# EAGLE design CKTPOWERTRAINEE (EAGLE 9.6.2)
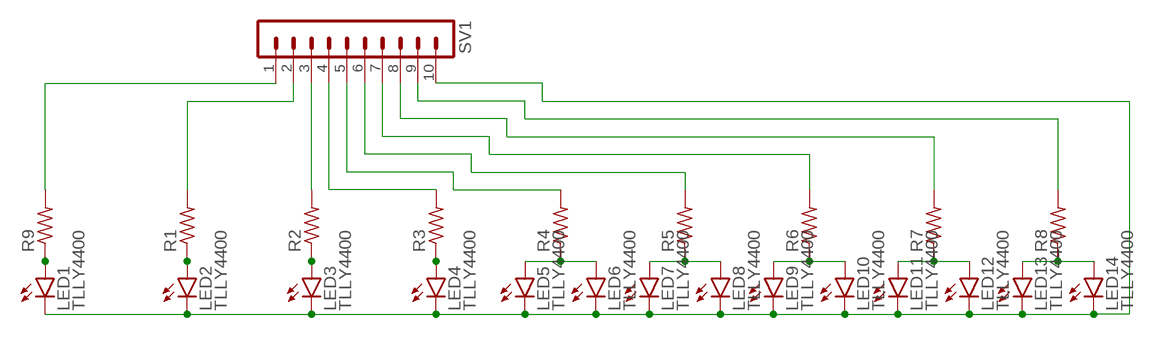
[diagram p0: schematic, sheet 1]

## Parts
LED1  TLLY4400  [LED3MM]
LED2  TLLY4400  [LED3MM]
LED3  TLLY4400  [LED3MM]
LED4  TLLY4400  [LED3MM]
LED5  TLLY4400  [LED3MM]
LED6  TLLY4400  [LED3MM]
LED7  TLLY4400  [LED3MM]
LED8  TLLY4400  [LED3MM]
LED9  TLLY4400  [LED3MM]
LED10  TLLY4400  [LED3MM]
LED11  TLLY4400  [LED3MM]
LED12  TLLY4400  [LED3MM]
LED13  TLLY4400  [LED3MM]
LED14  TLLY4400  [LED3MM]
R1  R-US_0309/12  [0309/12]
R2  R-US_0309/12  [0309/12]
R3  R-US_0309/12  [0309/12]
R4  R-US_0309/12  [0309/12]
R5  R-US_0309/12  [0309/12]
R6  R-US_0309/12  [0309/12]
R7  R-US_0309/12  [0309/12]
R8  R-US_0309/12  [0309/12]
R9  R-US_0309/12  [0309/12]
SV1  MA10-1  [MA10-1]

## Nets
N$1: LED1.A R9.1
N$2: LED2.A R1.1
N$3: LED3.A R2.1
N$4: LED4.A R3.1
N$5: LED5.A LED6.A R4.1
N$6: LED7.A LED8.A R5.1
N$7: LED9.A LED10.A R6.1
N$8: LED11.A LED12.A R7.1
N$9: LED13.A LED14.A R8.1
N$10: LED1.K(C) LED2.K(C) LED3.K(C) LED4.K(C) LED5.K(C) LED6.K(C) LED7.K(C) LED8.K(C) LED9.K(C) LED10.K(C) LED11.K(C) LED12.K(C) LED13.K(C) LED14.K(C) SV1.10
N$11: R9.2 SV1.1
N$12: R1.2 SV1.2
N$13: R2.2 SV1.3
N$14: R3.2 SV1.4
N$15: R4.2 SV1.5
N$16: R5.2 SV1.6
N$17: R6.2 SV1.7
N$18: R7.2 SV1.8
N$19: R8.2 SV1.9

## Library data of the parts
LED1-LED14 = led:TLLY4400: Low Current (2mA) LED 3 mm Tinted Diffused Package color YELLOW Source: Data sheet <http://www.farnell.com/datasheets/391098.pdf>; MF: VISHAY SEMICONDUCTOR; OC_FARNELL: 1612439
R1-R9 = resistor:R-US_: RESISTOR, American symbol
SV1 = con-lstb:MA10-1: PIN HEADER; OC_FARNELL: unknown; OC_NEWARK: unknown

## Board
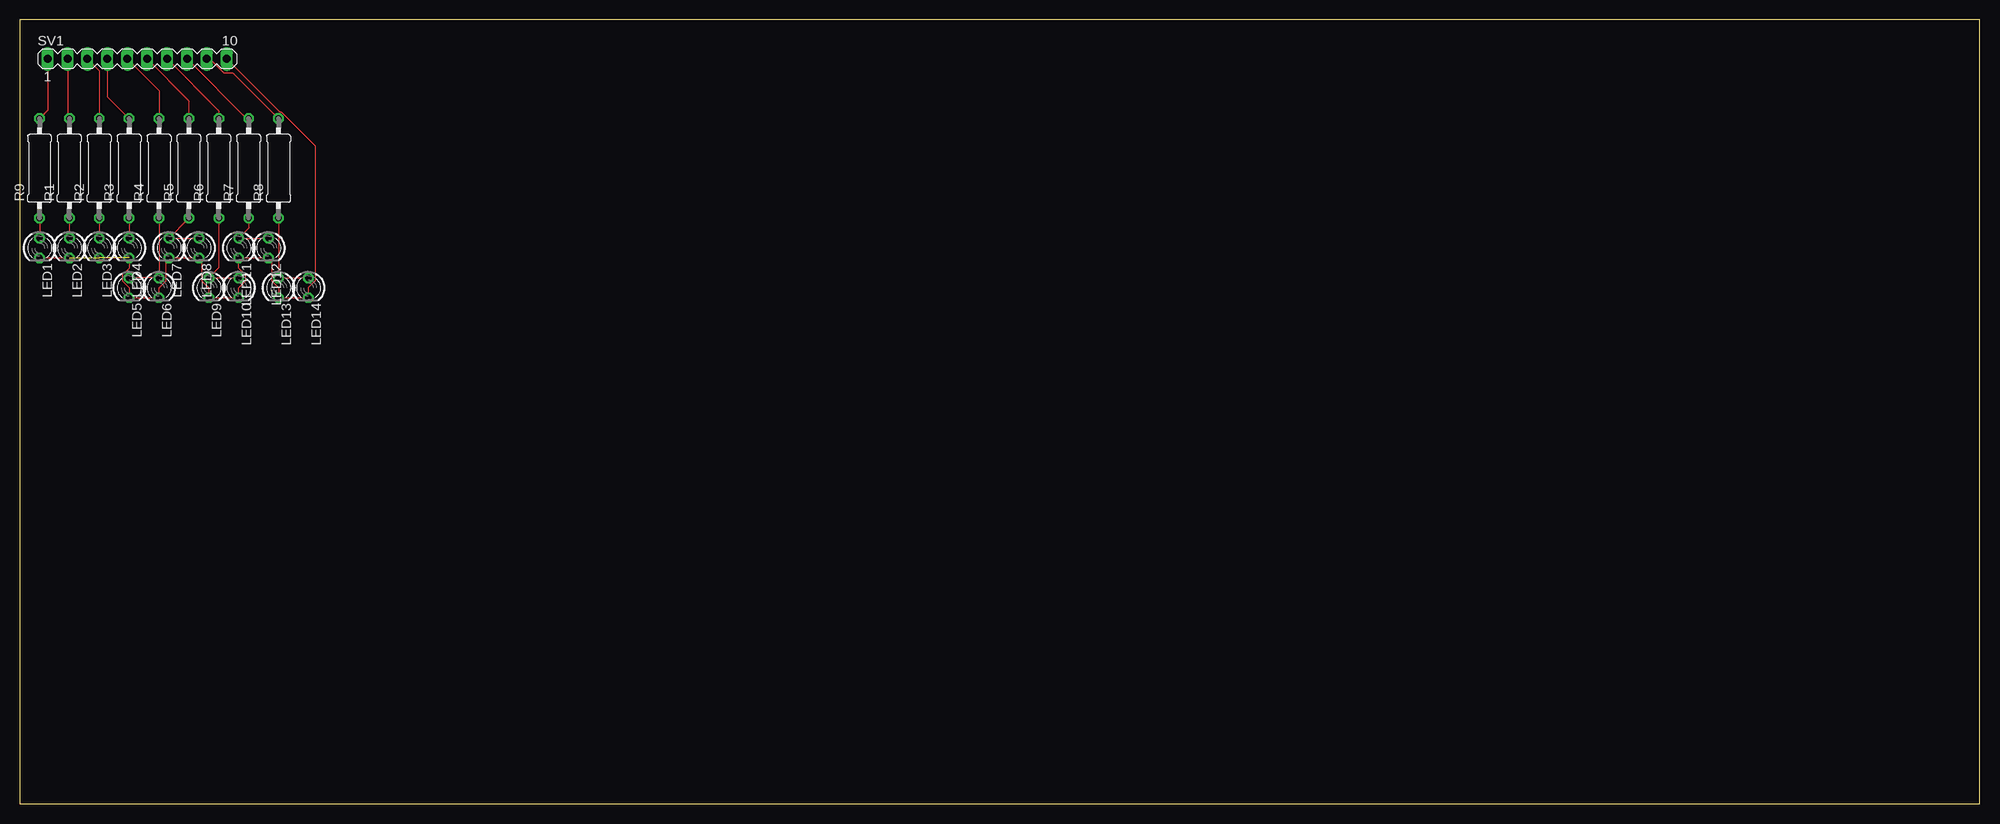
[diagram p1: board, top side]

Size 250 x 100 mm. Coordinates in mm from the lower left corner, seen from the top.
Outline: 0,0 250,0 250,100 0,100 0,0
Copper layers (1*16): Top 0.035mm / dielectric 1.5mm / Bottom 0.035mm
Design rules "default": minimum track width 6mil, minimum drill 0.35mm, track to track 6mil, track to pad 6mil, pad to pad 6mil, via to via 6mil, smd to smd 6mil, copper to edge 40mil, drill to drill 6mil, minimum pad ring 10mil, minimum via ring 8mil, stop-mask expansion 4mil, vias tented up to drill 0mil, thermal gap 10mil

### Footprints (pad centres in the part's own frame; a part is rotated, then mirrored left to right if it is on the bottom)
LED3MM = drill 0.813 octagon: A -1.27,0; K 1.27,0
0309/12 = drill 0.813 octagon: 1 -6.35,0; 2 6.35,0
MA10-1 = drill 1.016 long: 1 -11.43,0; 2 -8.89,0; 3 -6.35,0; 4 -3.81,0; 5 -1.27,0; 6 1.27,0; 7 3.81,0; 8 6.35,0; 9 8.89,0; 10 11.43,0

### Placement (x,y rotation side)
LED1  2.54,70.88 270 top
LED2  6.35,70.88 270 top
LED3  10.16,70.88 270 top
LED4  13.97,70.88 270 top
LED5  13.97,65.8 270 top
LED6  17.78,65.8 270 top
LED7  19.05,70.88 270 top
LED8  22.86,70.88 270 top
LED9  24.13,65.8 270 top
LED10  27.94,65.8 270 top
LED11  27.94,70.88 270 top
LED12  31.75,70.88 270 top
LED13  33.02,65.8 270 top
LED14  36.83,65.8 270 top
R1  6.35,81.04 90 top
R2  10.16,81.04 90 top
R3  13.97,81.04 90 top
R4  17.78,81.04 90 top
R5  21.59,81.04 90 top
R6  25.4,81.04 90 top
R7  29.21,81.04 90 top
R8  33.02,81.04 90 top
R9  2.54,81.04 90 top
SV1  15,95 0 top

### Tracks (layer width: path | path; a pad name or v marks a point on that pad's centre or on a via)
N$1
  Top 0.152: R9.1 LED1.A
N$2
  Top 0.152: R1.1 LED2.A
N$3
  Top 0.152: R2.1 LED3.A
N$4
  Top 0.152: R3.1 LED4.A
N$5
  Top 0.152: R4.1 LED6.A LED5.A
N$6
  Top 0.152: R5.1 LED7.A LED8.A
N$7
  Top 0.152: R6.1 25.4,68.34 LED9.A LED10.A
N$8
  Top 0.152: R7.1 29.21,73.42 LED11.A LED12.A
N$9
  Top 0.152: R8.1 LED13.A LED14.A
N$10  (2 unrouted)
  Top 0.152: LED1.K LED4.K 13.97,68.33 13.08,67.44 13.08,66.7 13.97,65.81 LED5.K LED6.K 17.78,65.81 18.67,66.7 18.67,69.23 LED7.K LED8.K 23.24,69.23 23.24,66.7 24.13,65.81 LED9.K LED10.K 27.94,65.81 28.83,66.7 28.83,67.44 27.94,68.33 LED11.K LED12.K 32.13,69.23 32.13,66.7 33.02,65.81 LED13.K LED14.K 36.83,65 36.83,65.81 37.72,66.7 37.72,83.95 33.39,88.28 33.15,88.28 SV1.10
N$11
  Top 0.152: SV1.1 3.57,88.42 R9.2
N$12
  Top 0.152: SV1.2 6.11,87.63 R1.2
N$13
  Top 0.152: SV1.3 10.16,93.49 R2.2
N$14
  Top 0.152: SV1.4 11.19,90.17 R3.2
N$15
  Top 0.152: SV1.5 17.78,90.95 R4.2
N$16
  Top 0.152: SV1.6 21.59,89.68 R5.2
N$17
  Top 0.152: SV1.7 25.4,88.41 R6.2
N$18
  Top 0.152: SV1.8 28.96,87.39 R7.2
N$19
  Top 0.152: R8.2 27.16,93.25 26.02,93.25 24.27,95 SV1.9